# Altium schematic sheet debugging_board_PFC161.SchDoc
size A4
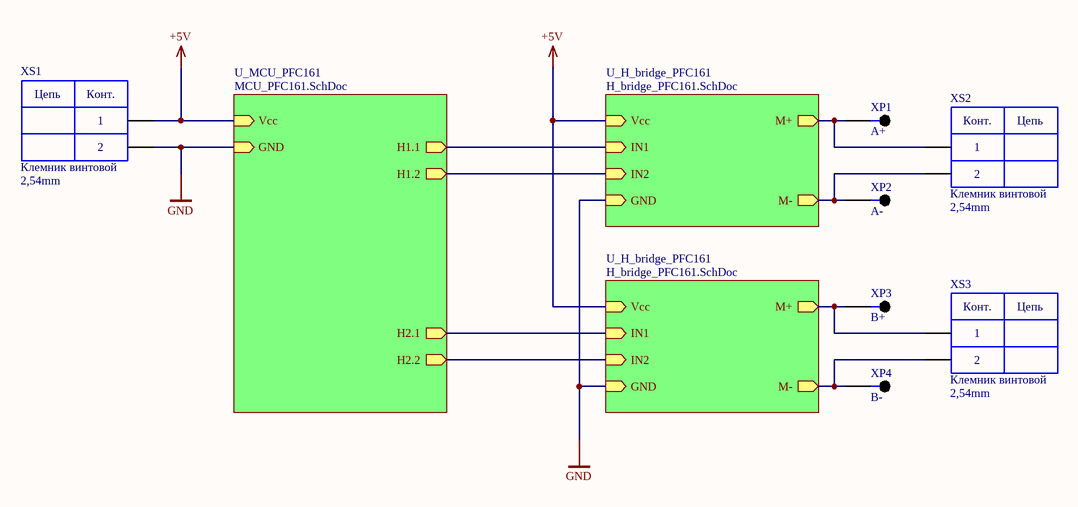
[diagram p0: debugging_board_PFC161.SchDoc]

## Parts
XP1  A+  [XP_solder]
XP2  A-  [XP_solder]
XP3  B+  [XP_solder]
XP4  B-  [XP_solder]
XS1  Клемник винтовой  Package: 2,54mm  [XS_2x2.54MM]
XS2  Клемник винтовой  Package: 2,54mm  [XS_2x2.54MM]
XS3  Клемник винтовой  Package: 2,54mm  [XS_2x2.54MM]

## Sub-sheets
U_H_bridge_PFC161 = H_bridge_PFC161.SchDoc: IN2 (in), IN1 (in), Vcc (in), M+ (out), M- (out), GND (in)
U_H_bridge_PFC161 = H_bridge_PFC161.SchDoc: IN2 (in), IN1 (in), Vcc (in), M+ (out), M- (out), GND (in)
U_MCU_PFC161 = MCU_PFC161.SchDoc: Vcc (in), GND (in), H1.1 (out), H1.2 (out), H2.1 (out), H2.2 (out)

## Nets
+5V: XS1.1 ; sheet U_MCU_PFC161/Vcc, sheet U_H_bridge_PFC161/Vcc, sheet U_H_bridge_PFC161/Vcc
GND: XS1.2 ; sheet U_MCU_PFC161/GND, sheet U_H_bridge_PFC161/GND, sheet U_H_bridge_PFC161/GND
NetXP1_1: XP1.1 XS2.1 ; sheet U_H_bridge_PFC161/M+
NetXP2_1: XP2.1 XS2.2 ; sheet U_H_bridge_PFC161/M-
NetXP3_1: XP3.1 XS3.1 ; sheet U_H_bridge_PFC161/M+
NetXP4_1: XP4.1 XS3.2 ; sheet U_H_bridge_PFC161/M-
(unnamed): sheet U_MCU_PFC161/H1.1, sheet U_H_bridge_PFC161/IN1
(unnamed): sheet U_MCU_PFC161/H1.2, sheet U_H_bridge_PFC161/IN2
(unnamed): sheet U_MCU_PFC161/H2.1, sheet U_H_bridge_PFC161/IN1
(unnamed): sheet U_MCU_PFC161/H2.2, sheet U_H_bridge_PFC161/IN2

## Notes on the sheet
- (in symbol Клемник винтовой 2-контактный, 2,54мм) Конт.; Цепь

## Library data of the parts
XP1-XP4 = XP_solder
XS1-XS3 = Клемник винтовой 2-контактный, 2,54мм: ValueBOM: 308-021-14, Клеммник винтовой, 2-контактный, 2.54мм, прямой; Type: XS; Value: Клемник винтовой